# EAGLE design motor-shield (EAGLE 6.2)
SN754410 motor shield
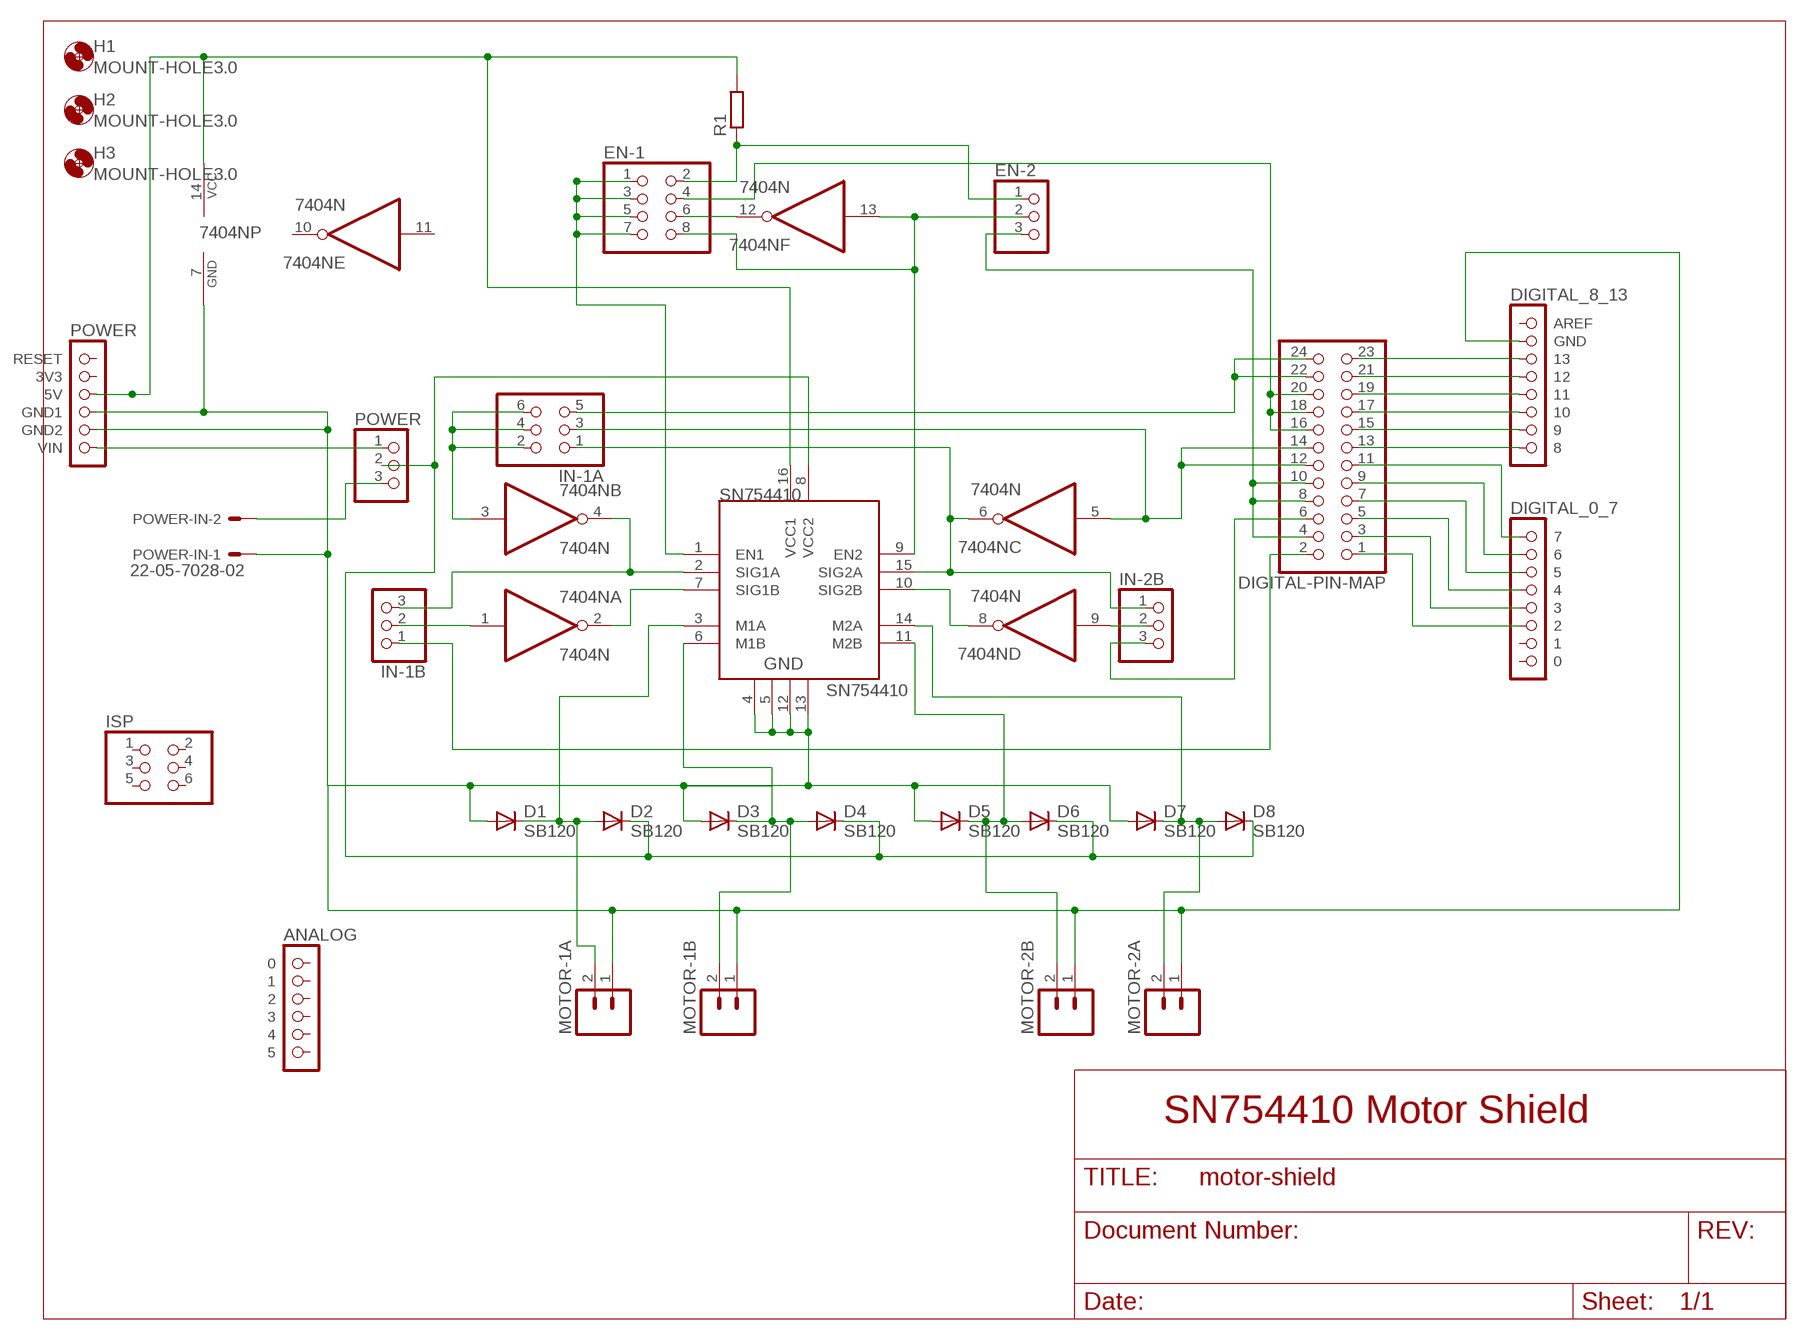
[diagram p0: schematic, sheet 1]

## Parts
7404N  7404N  [DIL14]
D1  SB120  [DO41-10]
D2  SB120  [DO41-10]
D3  SB120  [DO41-10]
D4  SB120  [DO41-10]
D5  SB120  [DO41-10]
D6  SB120  [DO41-10]
D7  SB120  [DO41-10]
D8  SB120  [DO41-10]
DIGITAL-PIN-MAP  PINHD-2X12  [2X12]
EN-1  PINHD-2X4  [2X04]
EN-2  PINHD-1X3  [1X03]
H1  MOUNT-HOLE3.0  [3,0]
H2  MOUNT-HOLE3.0  [3,0]
H3  MOUNT-HOLE3.0  [3,0]
IN-1A  PINHD-2X3  [2X03]
IN-1B  PINHD-1X3  [1X03]
IN-2B  PINHD-1X3  [1X03]
ISP  PINHD-2X3  [2X03]
MOTOR-1A  M023.5MM-NO_SILK  [SCREWTERMINAL-3.5MM-2-NS]
MOTOR-1B  M023.5MM-NO_SILK  [SCREWTERMINAL-3.5MM-2-NS]
MOTOR-2A  M023.5MM-NO_SILK  [SCREWTERMINAL-3.5MM-2-NS]
MOTOR-2B  M023.5MM-NO_SILK  [SCREWTERMINAL-3.5MM-2-NS]
POWER  PINHD-1X3  [1X03]
POWER-IN  22-05-7028-02  [7395-02]
R1  R-EU_0207/10  [0207/10]
SN754410  SN754410  [DIP16]
U$1  POWER  [1X06]
U$2  ANALOG  [1X06]
U$3  DIGITAL_0_7  [1X08]
U$4  DIGITAL_8_13  [1X08]

## Nets
5V: 7404N.14(P:VCC) R1.2 SN754410.16(VCC1) U$1.3(5V)
GND: 7404N.7(P:GND) D1.A D3.A D5.A D7.A MOTOR-1A.1 MOTOR-1B.1 MOTOR-2A.1 MOTOR-2B.1 POWER-IN.1 SN754410.4 SN754410.5 SN754410.12 SN754410.13 U$1.4(GND1) U$1.5(GND2) U$4.2(GND)
N$1: 7404N.4(B:O) IN-1B.3 SN754410.2(SIG1A)
N$2: 7404N.2(A:O) SN754410.7(SIG1B)
N$3: 7404N.6(C:O) IN-1A.1 IN-2B.1 SN754410.15(SIG2A)
N$4: 7404N.8(D:O) SN754410.10(SIG2B)
N$5: 7404N.9(D:I) IN-2B.2
N$6: 7404N.1(A:I) IN-1B.2
N$7: 7404N.12(F:O) EN-1.6
N$8: DIGITAL-PIN-MAP.23 U$4.3
N$9: EN-1.2 EN-2.1 R1.1
N$10: 7404N.13(F:I) EN-1.8 EN-2.2 SN754410.9(EN2)
N$11: 7404N.5(C:I) DIGITAL-PIN-MAP.12 DIGITAL-PIN-MAP.14 IN-1A.3
N$12: EN-1.1 EN-1.3 EN-1.5 EN-1.7 SN754410.1(EN1)
N$13: DIGITAL-PIN-MAP.16 DIGITAL-PIN-MAP.18 DIGITAL-PIN-MAP.20 EN-1.4
N$14: DIGITAL-PIN-MAP.4 DIGITAL-PIN-MAP.8 DIGITAL-PIN-MAP.10 EN-2.3
N$15: 7404N.3(B:I) IN-1A.2 IN-1A.4 IN-1A.6
N$16: DIGITAL-PIN-MAP.6 IN-2B.3
N$17: DIGITAL-PIN-MAP.2 IN-1B.1
N$18: DIGITAL-PIN-MAP.22 DIGITAL-PIN-MAP.24 IN-1A.5
N$20: DIGITAL-PIN-MAP.21 U$4.4
N$21: DIGITAL-PIN-MAP.19 U$4.5
N$22: DIGITAL-PIN-MAP.17 U$4.6
N$23: DIGITAL-PIN-MAP.15 U$4.7
N$24: DIGITAL-PIN-MAP.13 U$4.8
N$25: POWER.1 U$1.6(VIN)
N$29: DIGITAL-PIN-MAP.11 U$3.1
N$30: DIGITAL-PIN-MAP.9 U$3.2
N$31: DIGITAL-PIN-MAP.7 U$3.3
N$32: DIGITAL-PIN-MAP.5 U$3.4
N$33: DIGITAL-PIN-MAP.3 U$3.5
N$34: DIGITAL-PIN-MAP.1 U$3.6
N$36: D1.C D2.A MOTOR-1A.2 SN754410.3(M1A)
N$37: D3.C D4.A MOTOR-1B.2 SN754410.6(M1B)
N$39: D5.C D6.A MOTOR-2B.2 SN754410.11(M2B)
N$40: D7.C D8.A MOTOR-2A.2 SN754410.14(M2A)
V-MOTOR: D2.C D4.C D6.C D8.C POWER.2 SN754410.8(VCC2)
VEXT: POWER-IN.2 POWER.3
Unconnected: 7404N.10(E:O) 7404N.11(E:I) ISP.1 ISP.2 ISP.3 ISP.4 ISP.5 ISP.6 U$1.1(RESET) U$1.2(3V3) U$2.1 U$2.2 U$2.3 U$2.4 U$2.5 U$2.6 U$3.7 U$3.8 U$4.1(AREF)

## Notes on the sheet
- SN754410 Motor Shield

## Library data of the parts
7404N = 74xx-us:74*04: Hex INVERTER
D1-D8 = diode:SB120: DIODE barrier rectifier, 1 A (Fairchild)
DIGITAL-PIN-MAP = pinhead:PINHD-2X12: PIN HEADER
EN-1 = pinhead:PINHD-2X4: PIN HEADER
EN-2 IN-1B IN-2B POWER = pinhead:PINHD-1X3: PIN HEADER
H1-H3 = holes:MOUNT-HOLE: MOUNTING HOLE with drill center marker
IN-1A ISP = pinhead:PINHD-2X3: PIN HEADER
MOTOR-1A MOTOR-1B MOTOR-2A MOTOR-2B = SparkFun:M02: Header 2 Standard 2-pin 0.1" header. Use with straight break away headers (SKU : PRT-00116), right angle break away headers (PRT-00553), swiss pins (PRT-00743), machine pins (PRT-00117), and female headers (PRT-00115). Molex polarized connector foot print use with SKU : PRT-08233 with associated crimp pins and housings.
POWER-IN = con-molex:22-?-02: CONNECTOR wire to board 2.54 mm (.1 inch) pitch header; OC_FARNELL: 9731601; OC_NEWARK: unknown
R1 = resistor:R-EU_: RESISTOR, European symbol
SN754410 = HBridge:SN754410: Quadruple half-H driver
U$1 = arduino:POWER
U$2 = arduino:ANALOG
U$3 = arduino:DIGITAL_0_7
U$4 = arduino:DIGITAL_8_13

## Board
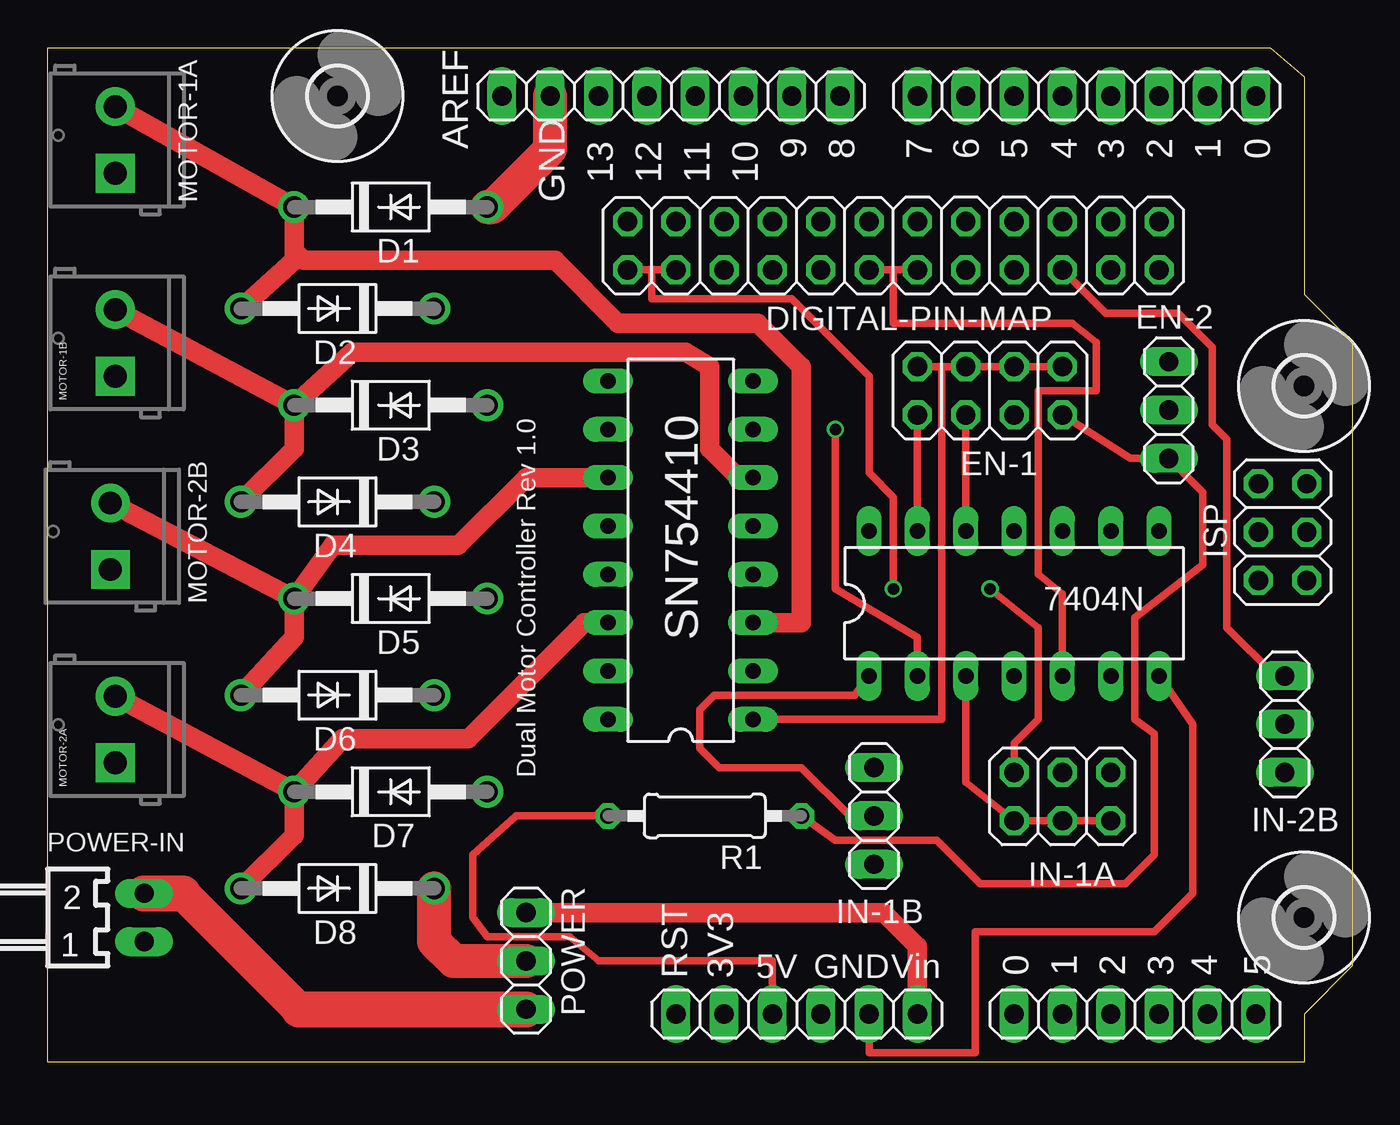
[diagram p1: board, top side]
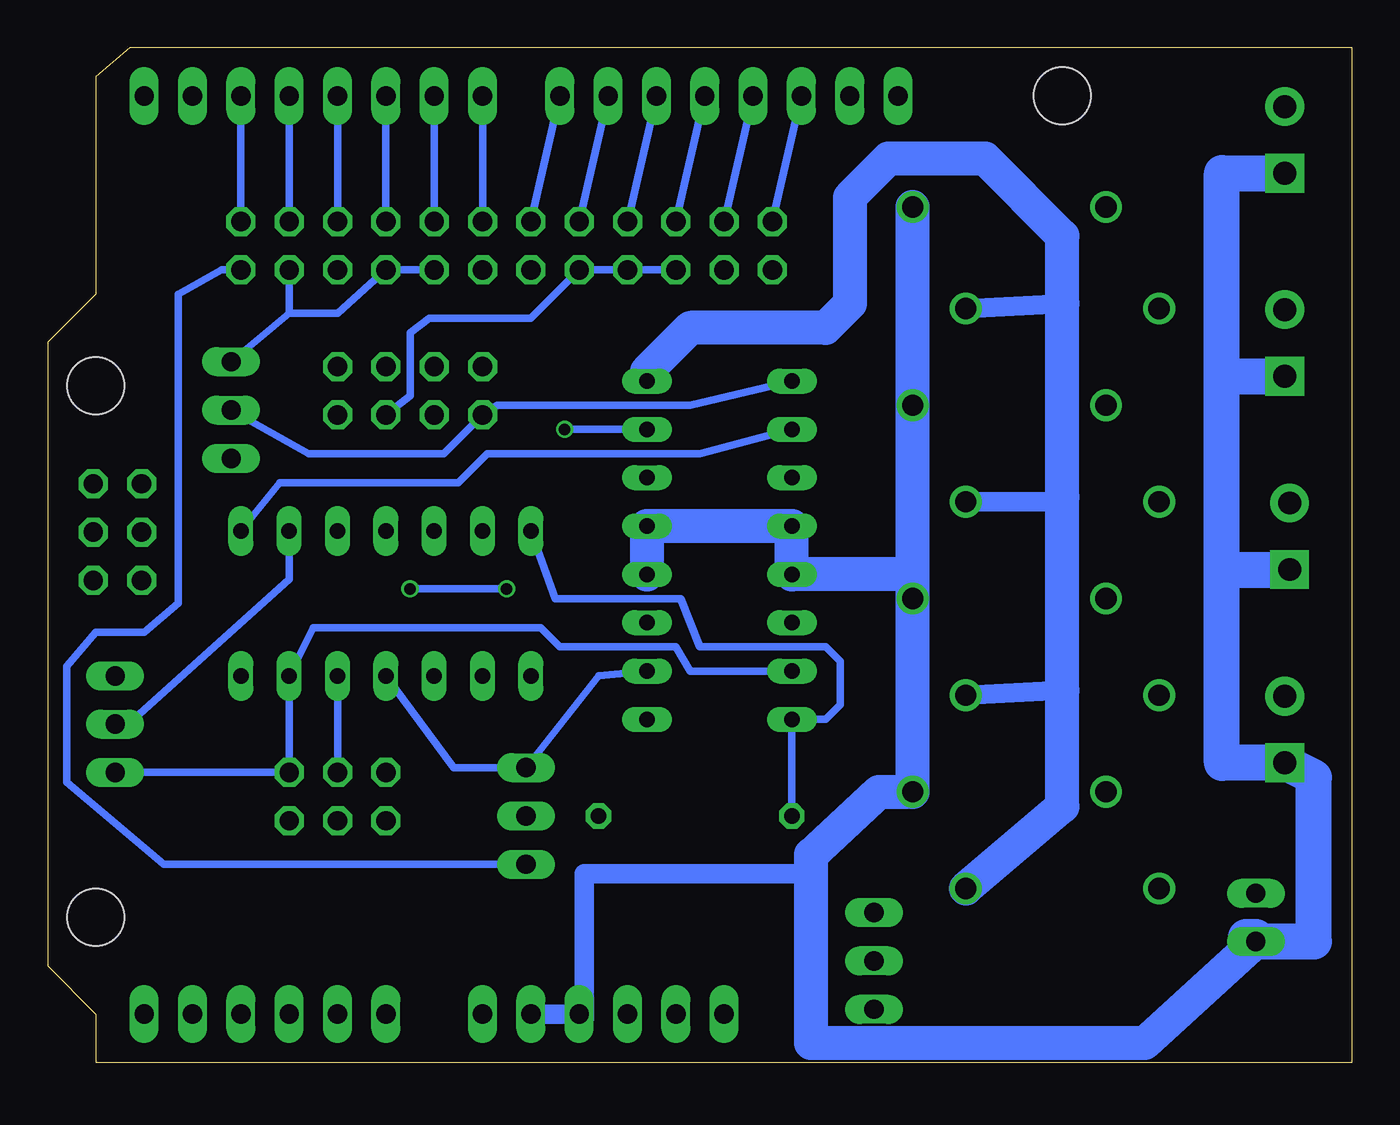
[diagram p2: board, bottom side, seen from below]

Size 68.58 x 53.34 mm. Coordinates in mm from the lower left corner, seen from the top.
Outline: 0,53.34 64.26,53.34 66.04,51.82 66.04,40.39 68.58,37.85 68.58,5.08 66.04,2.54 66.04,0 0,0 0,53.34
Copper layers (1*16): Top 0.035mm / dielectric 1.5mm / Bottom 0.035mm
Design rules: minimum track width 6mil, minimum drill 12mil, track to track 6mil, track to pad 6mil, pad to pad 6mil, via to via 6mil, smd to smd 0mil, copper to edge 10mil, drill to drill 10mil, minimum pad ring 10mil, minimum via ring 6mil, stop-mask expansion 2mil, vias tented up to drill 100mil, thermal gap 10mil

### Footprints (pad centres in the part's own frame; a part is rotated, then mirrored left to right if it is on the bottom)
DIL14 = drill 0.813 long: 1 -7.62,-3.81; 2 -5.08,-3.81; 3 -2.54,-3.81; 4 0,-3.81; 5 2.54,-3.81; 6 5.08,-3.81; 7 7.62,-3.81; 8 7.62,3.81; 9 5.08,3.81; 10 2.54,3.81; 11 0,3.81; 12 -2.54,3.81; 13 -5.08,3.81; 14 -7.62,3.81
DO41-10 = drill 1.118: A 5.08,0; C -5.08,0
2X12 = drill 1.016 octagon: 1 -13.97,-1.27; 2 -13.97,1.27; 3 -11.43,-1.27; 4 -11.43,1.27; 5 -8.89,-1.27; 6 -8.89,1.27; 7 -6.35,-1.27; 8 -6.35,1.27; 9 -3.81,-1.27; 10 -3.81,1.27; 11 -1.27,-1.27; 12 -1.27,1.27; 13 1.27,-1.27; 14 1.27,1.27; 15 3.81,-1.27; 16 3.81,1.27; 17 6.35,-1.27; 18 6.35,1.27; 19 8.89,-1.27; 20 8.89,1.27; 21 11.43,-1.27; 22 11.43,1.27; 23 13.97,-1.27; 24 13.97,1.27
2X04 = drill 1.016 octagon: 1 -3.81,-1.27; 2 -3.81,1.27; 3 -1.27,-1.27; 4 -1.27,1.27; 5 1.27,-1.27; 6 1.27,1.27; 7 3.81,-1.27; 8 3.81,1.27
1X03 = drill 1.016 long: 1 -2.54,0; 2 0,0; 3 2.54,0
3,0 = hole 3: 0,0
2X03 = drill 1.016 octagon: 1 -2.54,-1.27; 2 -2.54,1.27; 3 0,-1.27; 4 0,1.27; 5 2.54,-1.27; 6 2.54,1.27
SCREWTERMINAL-3.5MM-2-NS = drill 1.2 pad 2.032 square: 1 0,0 | drill 1.2 pad 2.032: 2 3.5,0
7395-02 = drill 1.016 long: 1 1.27,0; 2 -1.27,0
0207/10 = drill 0.813 octagon: 1 -5.08,0; 2 5.08,0
DIP16 = drill 0.813 long: 1 -10.16,-3.81; 2 -7.62,-3.81; 3 -5.08,-3.81; 4 -2.54,-3.81; 5 0,-3.81; 6 2.54,-3.81; 7 5.08,-3.81; 8 7.62,-3.81; 9 7.62,3.81; 10 5.08,3.81; 11 2.54,3.81; 12 0,3.81; 13 -2.54,3.81; 14 -5.08,3.81; 15 -7.62,3.81; 16 -10.16,3.81
1X06 = drill 1.016 long: 1 -6.35,0; 2 -3.81,0; 3 -1.27,0; 4 1.27,0; 5 3.81,0; 6 6.35,0
1X08 = drill 1.016 long: 1 -8.89,0; 2 -6.35,0; 3 -3.81,0; 4 -1.27,0; 5 1.27,0; 6 3.81,0; 7 6.35,0; 8 8.89,0

### Placement (x,y rotation side)
7404N  50.8,24.13 0 top
D1  18.03,44.96 0 top
D2  15.24,39.62 180 top
D3  18.03,34.54 0 top
D4  15.24,29.46 180 top
D5  18.03,24.38 0 top
D6  15.24,19.3 180 top
D7  18.03,14.22 0 top
D8  15.24,9.14 180 top
DIGITAL-PIN-MAP  44.45,42.93 180 top
EN-1  49.53,35.31 180 top
EN-2  58.93,34.29 90 top
H1  15.24,50.8 0 top
H2  66.04,35.56 0 top
H3  66.04,7.62 0 top
IN-1A  53.34,13.97 180 top
IN-1B  43.43,12.95 90 top
IN-2B  65.02,17.78 90 top
ISP  64.91,27.88 270 top
MOTOR-1A  3.56,46.74 90 top
MOTOR-1B  3.56,36.07 90 top
MOTOR-2A  3.56,15.75 90 top
MOTOR-2B  3.3,25.91 90 top
POWER  25.15,5.33 270 top
POWER-IN  5.08,7.62 270 top
R1  34.54,12.95 180 top
SN754410  33.27,28.19 90 top
U$1  39.37,2.54 0 top
U$2  57.15,2.54 0 top
U$3  54.61,50.8 0 top
U$4  32.77,50.8 0 top

### Tracks (layer width: path | path; a pad name or v marks a point on that pad's centre or on a via)
5V
  Top 0.406: U$1.3 38.1,5.33 28.96,5.33 27.43,6.6 23.11,6.6 22.35,7.62 22.35,10.92 24.64,12.95 R1.2
  Bottom 0.406: 7404N.14 41.91,24.38 35.31,24.38 34.29,21.84 27.69,21.84 26.92,21.08 26.92,18.8 27.69,18.03 SN754410.16 R1.2
GND
  Top 0.406: 7404N.7 60.2,17.78 60.2,8.89 58.17,6.86 48.77,6.86 48.77,0.51 43.18,0.51 U$1.5
  Top 1.778: D1.A 23.37,44.96 26.42,48.01 U$4.2
  Bottom 1.016: U$1.5 U$1.4 40.39,2.29 40.39,9.91 28.45,9.91 | D5.A 23.62,25.65
  Bottom 1.778: POWER-IN.1 10.92,1.02 28.45,1.02 28.45,9.91 28.45,10.92 24.89,14.22 D7.A D5.A D3.A D1.A | 23.62,25.65 SN754410.13 SN754410.12 SN754410.5 SN754410.4
  Bottom 1.905: POWER-IN.1 2.03,6.35 2.03,14.99 MOTOR-2A.1 6.86,15.75 6.86,25.91 | 6.86,25.91 MOTOR-2B.1 | 6.86,25.91 6.86,36.07 | 6.86,36.07 MOTOR-1B.1 | 6.86,36.07 6.86,46.74 MOTOR-1A.1
N$1
  Bottom 0.406: SN754410.2 39.62,20.32 IN-1B.3 47.24,15.49 7404N.4
N$2  (via drill 0.6)
  Top 0.406: 7404N.2 45.72,22.35 41.4,24.89 v41.4,33.27
  Bottom 0.406: v41.4,33.27 SN754410.7
N$3
  Bottom 0.406: IN-2B.1 IN-1A.1 7404N.6 54.61,22.86 42.67,22.86 41.66,21.84 35.56,21.84 34.8,20.57 SN754410.15
N$4
  Bottom 0.406: SN754410.10 34.29,32 45.47,32 46.99,30.48 56.39,30.48 7404N.8
N$5
  Bottom 0.406: 7404N.9 55.88,25.4 63.75,18.29 IN-2B.2
N$6
  Top 0.406: IN-1B.2 42.16,12.95 39.62,15.49 35.31,15.49 34.29,16.51 34.29,18.54 35.05,19.3 42.42,19.3 7404N.1
N$7
  Top 0.406: 7404N.12 EN-1.6
N$8
  Bottom 0.406: U$4.3 DIGITAL-PIN-MAP.23
N$9
  Top 0.406: EN-1.2 56.9,31.75 EN-2.1 60.71,29.97 60.71,26.16 57.15,23.37 57.15,18.03 58.17,17.27 58.17,10.92 56.64,9.4 49.02,9.4 46.74,11.68 41.4,11.68 R1.1
N$10
  Top 0.406: EN-1.8 7404N.13
  Bottom 0.406: SN754410.9 34.8,34.54 44.96,34.54 EN-1.8 47.75,32 54.86,32 EN-2.2
N$11
  Top 0.406: 7404N.5 53.34,24.64 52.07,25.65 52.07,35.31 55.12,35.31 55.12,37.85 53.85,38.86 44.45,38.86 44.45,41.66 | 44.45,41.66 DIGITAL-PIN-MAP.14 | 44.45,41.66 DIGITAL-PIN-MAP.12
  Bottom 0.406: IN-1A.3 7404N.5
N$12
  Top 0.406: SN754410.1 46.99,18.03 46.99,36.58 | 46.99,36.58 EN-1.7 | 46.99,36.58 EN-1.5 EN-1.3 EN-1.1
N$13
  Bottom 0.406: DIGITAL-PIN-MAP.20 DIGITAL-PIN-MAP.18 DIGITAL-PIN-MAP.16 43.18,39.12 48.51,39.12 49.53,38.35 49.53,35.05 EN-1.4
N$14
  Bottom 0.406: 55.88,39.37 EN-2.3 | 55.88,39.37 DIGITAL-PIN-MAP.4 | 55.88,39.37 53.34,39.37 DIGITAL-PIN-MAP.8 DIGITAL-PIN-MAP.10
N$15
  Top 0.406: 7404N.3 48.26,14.73 IN-1A.6 IN-1A.4 IN-1A.2
N$16
  Top 0.406: DIGITAL-PIN-MAP.6 55.63,39.37 59.44,39.37 61.21,37.59 61.21,33.53 61.98,32.77 61.98,22.86 64.52,20.32 IN-2B.3
N$17
  Bottom 0.406: DIGITAL-PIN-MAP.2 59.44,41.66 61.72,40.39 61.72,24.13 63.5,22.61 66.04,22.61 67.56,20.83 67.56,14.73 62.48,10.41 IN-1B.1
N$18  (via drill 0.6)
  Top 0.406: IN-1A.5 50.8,16.76 52.07,18.03 52.07,22.86 v49.53,24.89 | v44.45,24.89 44.45,29.72 43.18,30.99 43.18,36.07 39.12,40.13 31.75,40.13 31.75,41.66 | 31.75,41.66 DIGITAL-PIN-MAP.24 | 31.75,41.66 DIGITAL-PIN-MAP.22
  Bottom 0.406: v49.53,24.89 v44.45,24.89
N$20
  Bottom 0.406: U$4.4 DIGITAL-PIN-MAP.21
N$21
  Bottom 0.406: U$4.5 DIGITAL-PIN-MAP.19
N$22
  Bottom 0.406: U$4.6 DIGITAL-PIN-MAP.17
N$23
  Bottom 0.406: U$4.7 DIGITAL-PIN-MAP.15
N$24
  Bottom 0.406: U$4.8 DIGITAL-PIN-MAP.13
N$25
  Top 1.016: POWER.1 43.94,7.87 45.72,6.1 U$1.6
N$26
  Bottom 1.905: 5.59,6.6 5.08,6.6
N$29
  Bottom 0.406: U$3.1 DIGITAL-PIN-MAP.11
N$30
  Bottom 0.406: U$3.2 DIGITAL-PIN-MAP.9
N$31
  Bottom 0.406: U$3.3 DIGITAL-PIN-MAP.7
N$32
  Bottom 0.406: U$3.4 DIGITAL-PIN-MAP.5
N$33
  Bottom 0.406: U$3.5 DIGITAL-PIN-MAP.3
N$34
  Bottom 0.406: U$3.6 DIGITAL-PIN-MAP.1
N$36
  Top 1.016: D2.A 12.95,42.16 12.95,42.67 | 12.95,42.67 D1.C MOTOR-1A.2 | 12.95,42.67 13.46,42.16 26.67,42.16 29.97,38.86 37.34,38.86 39.62,36.58 39.62,23.11 SN754410.3
N$37
  Top 1.016: D4.A 12.95,32.26 D3.C | SN754410.6 36.32,30.73 34.8,32.26 34.8,36.58 33.53,37.34 16,37.34 D3.C | D3.C MOTOR-1B.2
N$39
  Top 1.016: D5.C 12.95,22.35 D6.A 10.1,19.25 | D5.C 14.99,27.18 21.59,27.18 25.15,30.73 SN754410.11 | D5.C MOTOR-2B.2
N$40
  Top 1.016: D8.A 12.95,11.94 D7.C | D7.C 15.49,17.02 22.1,17.02 28.19,23.11 SN754410.14 | D7.C MOTOR-2A.2
V-MOTOR
  Top 1.778: D8.C 20.32,6.35 21.34,5.33 POWER.2
  Bottom 1.016: D6.C 15.24,19.56 | D4.C 15.49,29.46 15.24,29.72 | D2.C 15.24,39.88 | 37.08,36.32 SN754410.8
  Bottom 1.778: D8.C 15.24,13.46 15.24,19.56 15.24,29.72 15.24,39.88 15.24,43.43 19.3,47.5 24.38,47.5 26.42,45.47 26.42,39.88 27.69,38.61 34.8,38.61 37.08,36.32
VEXT
  Top 1.778: 7.11,8.89 13.21,2.79
  Top 1.905: POWER-IN.2 7.11,8.89 | 13.21,2.79 POWER.3

### Text on the board
tNames: AREF | 9 | 8 | 7 | 6 | 5 | 4 | 3 | 2 | 1 | 0 | 13 | 12 | 11 | 10 | GND | Dual Motor Controller Rev 1.0 | 0 | 1 | 2 | 3 | 4 | 5 | RST | 3V3 | 5V | GND | Vin
TallParts: USB | ISP | PWR